# EAGLE design SNARFBASE-v03jj-232-buck (EAGLE 5.11)
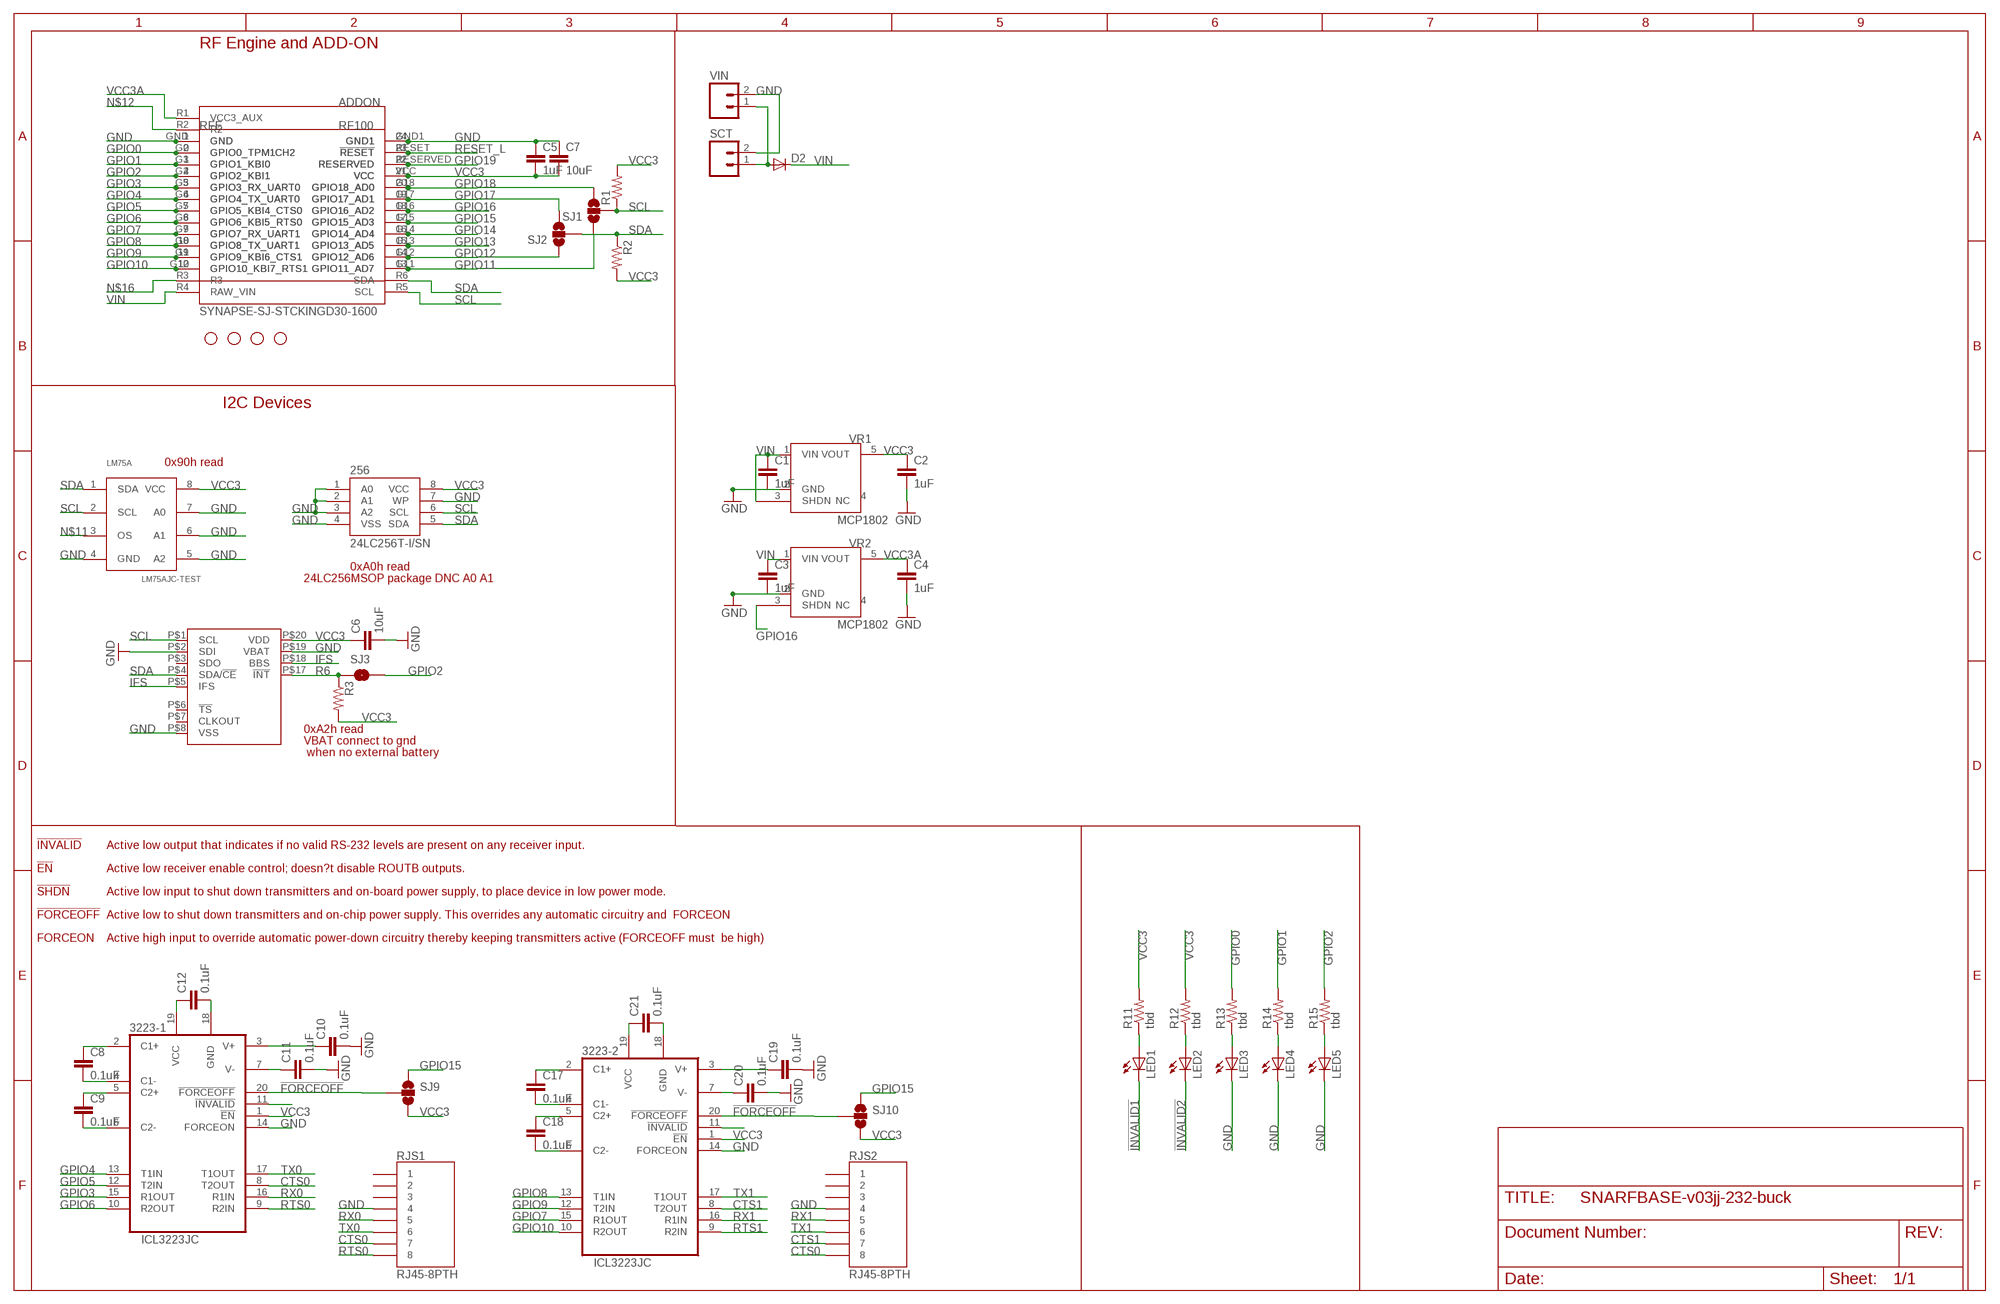
[diagram p0: schematic, sheet 1]

## Parts
256  24LC256T-I/SN  EEPROM-I2CSMD  [SO08]
3223-1  ICL3223JC  [TSSOP20-JC]
3223-2  ICL3223JC  [TSSOP20-JC]
ADDON  SYNAPSE-SJ-STCKINGD30-1600  [SYNSJ-STACK]
C1  1uF  CAP0805  [0805]
C2  1uF  CAP0805  [0805]
C3  1uF  CAP0805  [0805]
C4  1uF  CAP0805  [0805]
C5  1uF  CAP0805  [0805]
C6  10uF  CAP0805  [0805]
C7  10uF  CAP0805  [0805]
C8  0.1uF  CAP0805  [0805]
C9  0.1uF  CAP0805  [0805]
C10  0.1uF  CAP0805  [0805]
C11  0.1uF  CAP0805  [0805]
C12  0.1uF  CAP0805  [0805]
C17  0.1uF  CAP0805  [0805]
C18  0.1uF  CAP0805  [0805]
C19  0.1uF  CAP0805  [0805]
C20  0.1uF  CAP0805  [0805]
C21  0.1uF  CAP0805  [0805]
D2  DIODESMA  [SMA-DIODE]
JP6  STAND-OFF  [STAND-OFF]
JP9  STAND-OFF  [STAND-OFF]
JP10  STAND-OFF  [STAND-OFF]
JP11  STAND-OFF  [STAND-OFF]
LED1  LED0603  [LED-0603]
LED2  LED0603  [LED-0603]
LED3  LED0603  [LED-0603]
LED4  LED0603  [LED-0603]
LED5  LED0603  [LED-0603]
LM75A  LM75AJC-TEST  [TSSOP8-3MM]
PCF2129A  PCF2129ASO20  [SO20W]
R1  RESISTOR  [0805]
R2  RESISTOR  [0805]
R3  RESISTOR  [0805]
R11  tbd  RESISTOR0603-RES  [0603-RES]
R12  tbd  RESISTOR0603-RES  [0603-RES]
R13  tbd  RESISTOR0603-RES  [0603-RES]
R14  tbd  RESISTOR0603-RES  [0603-RES]
R15  tbd  RESISTOR0603-RES  [0603-RES]
RFE  RFE  RF100-JACKJACK2  [SYNAPSERFENGINE-THM-SMT-JACK2]
RJS1  RJ45-8PTH  [RJ45-8]
RJS2  RJ45-8PTH  [RJ45-8]
SCT  M023.5MM  [SCREWTERMINAL-3.5MM-2]
SJ1  SOLDERJUMPER_2WAYS  [SJ_3]
SJ2  SOLDERJUMPER_2WAYS  [SJ_3]
SJ3  SOLDERJUMPERNC2  [SJ_2S-NOTRACE]
SJ9  SOLDERJUMPER_2WAYPASTE1&2  [SJ_3_PASTE1&2]
SJ10  SOLDERJUMPER_2WAYPASTE1&2  [SJ_3_PASTE1&2]
VIN  M02PTH  [1X02]
VR1  MCP1802  [SOT23-5]
VR2  MCP1802  [SOT23-5]

## Nets
!FORCEOFF: 3223-1.20(!FORCEOFF) 3223-2.20(!FORCEOFF) SJ9.2 SJ10.2
!INVALID1: 3223-1.11(!INVALID) LED1.C
!INVALID2: 3223-2.11(!INVALID) LED2.C
CTS0: 3223-1.8(T2OUT) RJS1.7 RJS2.8
CTS1: 3223-2.8(T2OUT) RJS2.7
GND: 256.1(A0) 256.2(A1) 256.3(A2) 256.4(VSS) 256.7(WP) 3223-1.14(FORCEON) 3223-1.18(GND) 3223-2.14(FORCEON) 3223-2.18(GND) ADDON.GND ADDON.GND1 C1.2 C2.2 C3.2 C4.2 C5.1 C6.2 C7.1 C10.2 C11.2 C12.2 C19.2 C20.2 C21.2 LED3.C LED4.C LED5.C LM75A.4(GND) LM75A.5(A2) LM75A.6(A1) LM75A.7(A0) PCF2129A.P$2(SDI) PCF2129A.P$8(VSS) PCF2129A.P$19(VBAT) RFE.1(GND) RFE.24(GND1) RFE.P1 RFE.P24 RFE.P201 RFE.P224 RJS1.4 RJS2.4 SCT.2 VIN.2 VR1.2(GND) VR2.2(GND)
GPIO0: ADDON.G0(GPIO0_TPM1CH2) R13.2 RFE.2(GPIO0_TPM1CH2) RFE.P2 RFE.P202
GPIO1: ADDON.G1(GPIO1_KBI0) R14.2 RFE.3(GPIO1_KBI0) RFE.P3 RFE.P203
GPIO2: ADDON.G2(GPIO2_KBI1) R15.2 RFE.4(GPIO2_KBI1) RFE.P4 RFE.P204 SJ3.2
GPIO3: 3223-1.15(R1OUT) ADDON.G3(GPIO3_RX_UART0) RFE.5(GPIO3_RX_UART0) RFE.P5 RFE.P205
GPIO4: 3223-1.13(T1IN) ADDON.G4(GPIO4_TX_UART0) RFE.6(GPIO4_TX_UART0) RFE.P6 RFE.P206
GPIO5: 3223-1.12(T2IN) ADDON.G5(GPIO5_KBI4_CTS0) RFE.7(GPIO5_KBI4_CTS0) RFE.P7 RFE.P207
GPIO6: 3223-1.10(R2OUT) ADDON.G6(GPIO6_KBI5_RTS0) RFE.8(GPIO6_KBI5_RTS0) RFE.P8 RFE.P208
GPIO7: 3223-2.15(R1OUT) ADDON.G7(GPIO7_RX_UART1) RFE.9(GPIO7_RX_UART1) RFE.P9 RFE.P209
GPIO8: 3223-2.13(T1IN) ADDON.G8(GPIO8_TX_UART1) RFE.10(GPIO8_TX_UART1) RFE.P10 RFE.P210
GPIO9: 3223-2.12(T2IN) ADDON.G9(GPIO9_KBI6_CTS1) RFE.11(GPIO9_KBI6_CTS1) RFE.P11 RFE.P211
GPIO10: 3223-2.10(R2OUT) ADDON.G10(GPIO10_KBI7_RTS1) RFE.12(GPIO10_KBI7_RTS1) RFE.P12 RFE.P212
GPIO11: ADDON.G11(GPIO11_AD7) RFE.13(GPIO11_AD7) RFE.P13 RFE.P213 SJ1.1
GPIO12: ADDON.G12(GPIO12_AD6) RFE.14(GPIO12_AD6) RFE.P14 RFE.P214 SJ2.1
GPIO13: ADDON.G13(GPIO13_AD5) RFE.15(GPIO13_AD5) RFE.P15 RFE.P215
GPIO14: ADDON.G14(GPIO14_AD4) RFE.16(GPIO14_AD4) RFE.P16 RFE.P216
GPIO15: ADDON.G15(GPIO15_AD3) RFE.17(GPIO15_AD3) RFE.P17 RFE.P217 SJ9.1 SJ10.1
GPIO16: ADDON.G16(GPIO16_AD2) RFE.18(GPIO16_AD2) RFE.P18 RFE.P218 VR2.3(SHDN)
GPIO17: ADDON.G17(GPIO17_AD1) RFE.19(GPIO17_AD1) RFE.P19 RFE.P219 SJ2.3
GPIO18: ADDON.G18(GPIO18_AD0) RFE.20(GPIO18_AD0) RFE.P20 RFE.P220 SJ1.3
GPIO19: ADDON.RESERVED RFE.22(RESERVED) RFE.P22 RFE.P222
IFS: PCF2129A.P$5(IFS) PCF2129A.P$18(BBS)
N$1: LED1.A R11.1
N$2: LED2.A R12.1
N$3: LED3.A R13.1
N$4: 3223-1.2(C1+) C8.1
N$5: LED4.A R14.1
N$6: 3223-1.4(C1-) C8.2
N$7: 3223-1.3(V+) C10.1
N$8: 3223-1.7(V-) C11.1
N$9: LED5.A R15.1
N$11: LM75A.3(OS)
N$12: ADDON.R2
N$13: 3223-1.5(C2+) C9.1
N$14: 3223-1.6(C2-) C9.2
N$15: 3223-2.2(C1+) C17.1
N$16: ADDON.R3
N$17: 3223-2.4(C1-) C17.2
N$18: 3223-2.3(V+) C19.1
N$19: 3223-2.7(V-) C20.1
N$20: 3223-2.5(C2+) C18.1
N$21: 3223-2.6(C2-) C18.2
R6: PCF2129A.P$17(!INT) R3.1 SJ3.1
RESET_L: ADDON.RESET(!RESET) RFE.23(!RESET) RFE.P23 RFE.P223
RTS0: 3223-1.9(R2IN) RJS1.8
RTS1: 3223-2.9(R2IN)
RX0: 3223-1.16(R1IN) RJS1.5
RX1: 3223-2.16(R1IN) RJS2.5
SCL: 256.6(SCL) ADDON.R5(SCL) LM75A.2(SCL) PCF2129A.P$1(SCL) R1.1 SJ1.2
SDA: 256.5(SDA) ADDON.R6(SDA) LM75A.1(SDA) PCF2129A.P$4(SDA/!CE) R2.1 SJ2.2
TX0: 3223-1.17(T1OUT) RJS1.6
TX1: 3223-2.17(T1OUT) RJS2.6
VCC3: 256.8(VCC) 3223-1.1(!EN) 3223-1.19(VCC) 3223-2.1(!EN) 3223-2.19(VCC) ADDON.VCC C2.1 C5.2 C6.1 C7.2 C12.1 C21.1 LM75A.8(VCC) PCF2129A.P$20(VDD) R1.2 R2.2 R3.2 R11.2 R12.2 RFE.21(VCC) RFE.P21 RFE.P221 SJ9.3 SJ10.3 VR1.5(VOUT)
VCC3A: ADDON.R1(VCC3_AUX) C4.1 VR2.5(VOUT)
VIN: ADDON.R4(RAW_VIN) C1.1 C3.1 D2.C VR1.1(VIN) VR1.3(SHDN) VR2.1(VIN)
VIN_PREDIODE: D2.A SCT.1 VIN.1
Unconnected: PCF2129A.P$3(SDO) PCF2129A.P$6(!TS) PCF2129A.P$7(CLKOUT) RJS1.1 RJS1.2 RJS1.3 RJS2.1 RJS2.2 RJS2.3 VR1.4(NC) VR2.4(NC)

## Notes on the sheet
- RF Engine and ADD-ON
- I2C Devices
- 0x90h read
- 0xA0h read
- 24LC256MSOP package DNC A0 A1
- 0xA2h read
- VBAT connect to gnd
- when no external battery
- !INVALID | Active low output that indicates if no valid RS-232 levels are present on any receiver input.
- !EN | Active low receiver enable control; doesn?t disable ROUTB outputs.
- !SHDN | Active low input to shut down transmitters and on-board power supply, to place device in low power mode.
- !FORCEOFF | Active low to shut down transmitters and on-chip power supply. This overrides any automatic circuitry and  FORCEON
- FORCEON | Active high input to override automatic power-down circuitry thereby keeping transmitters active (FORCEOFF must  be high)

## Library data of the parts
256 = SparkFun:EEPROM-I2C
3223-1 3223-2 = 0_jc-custom:ICL3223
ADDON = 0_jc-custom:SYNAPSE-SJ-STCKING: Standard layout for expansion modules using Synapse Wireless boards
C1-C12 C17-C21 = 0_jc-custom:CAP: Capacitor Standard 0603 ceramic capacitor, and 0.1" leaded capacitor.
D2 = SparkFun:DIODE: Diode These are standard reverse protection diodes and small signal diodes. SMA package can handle up to about 1A. SOD-323 can handle about 200mA. What the SOD-323 package when ordering, there are some mfgs out there that are 5-pin packages.
JP6 JP9-JP11 = SparkFun:STAND-OFF: Stand Off This is the mechanical footprint for a #4 phillips button head screw. Use the keepout ring to avoid running the screw head into surrounding components. SKU : PRT-00447
LED1-LED5 = 0_jc-custom:LED: LEDs Standard schematic elements and footprints for 5mm, 3mm, 1206, and 0603 sized LEDs. 5mm - Spark Fun Electronics SKU : COM-00529 (and others)
LM75A = 0_jc-custom:LM75A
PCF2129A = 0_jc-custom:PCF2129A
R1-R3 = SparkFun:RESISTOR: Resistor Basic schematic elements and footprints for 0603, 1206, and PTH 1/10th watt (small) resistors.
R11-R15 = 0_jc-custom:RESISTOR
RFE = 0_jc-custom:RF100-JACK
RJS1 RJS2 = SparkFun:RJ45-8: RJ45 Jack Simple RJ45, 8-pin connection - connector for common Cat5, Cat5e, and Cat6 Ethernet cables. Footprint not yet proven in production. Connector sku is PRT-00643; Breakout PCB sku is BOB-00716.
SCT VIN = SparkFun:M02: Header 2 Standard 2-pin 0.1" header. Use with straight break away headers (SKU : PRT-00116), right angle break away headers (PRT-00553), swiss pins (PRT-00743), machine pins (PRT-00117), and female headers (PRT-00115). Molex polarized connector foot print use with SKU : PRT-08233 with associated crimp pins and housings.
SJ1 SJ2 SJ9 SJ10 = SparkFun:SOLDERJUMPER_2WAY: Solder Jumper 2 way solder jumper
SJ3 = SparkFun:SOLDERJUMPER: Solder Jumper Standard SMD solder jumper. Used to automate production. Two varients : Normally Open and Normally Closed are the same, but have different paste layers. NC will have a large amount of paste and should jumper during reflow.
VR1 VR2 = 0_jc-custom:MCP1802

## Net classes
0 default: width 0.254 mm
1 Power: width 0.508 mm
2 smallsignal: width 0.152 mm
3 stdsignal: width 0.254 mm

## Board
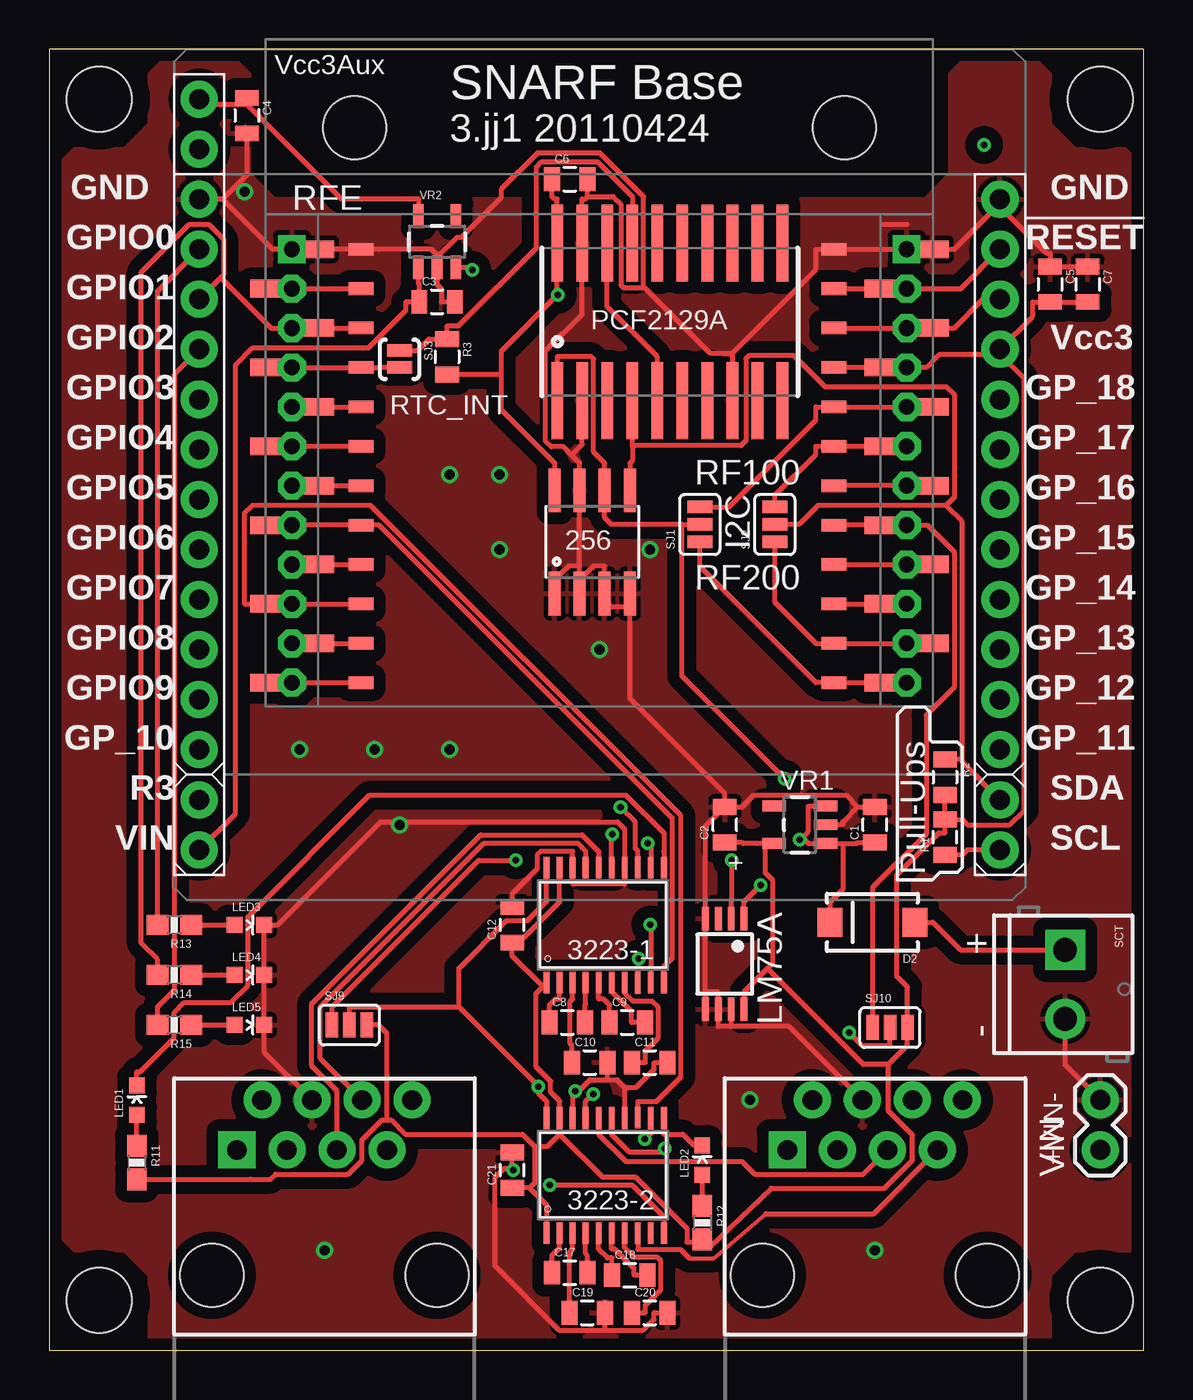
[diagram p1: board, top side]
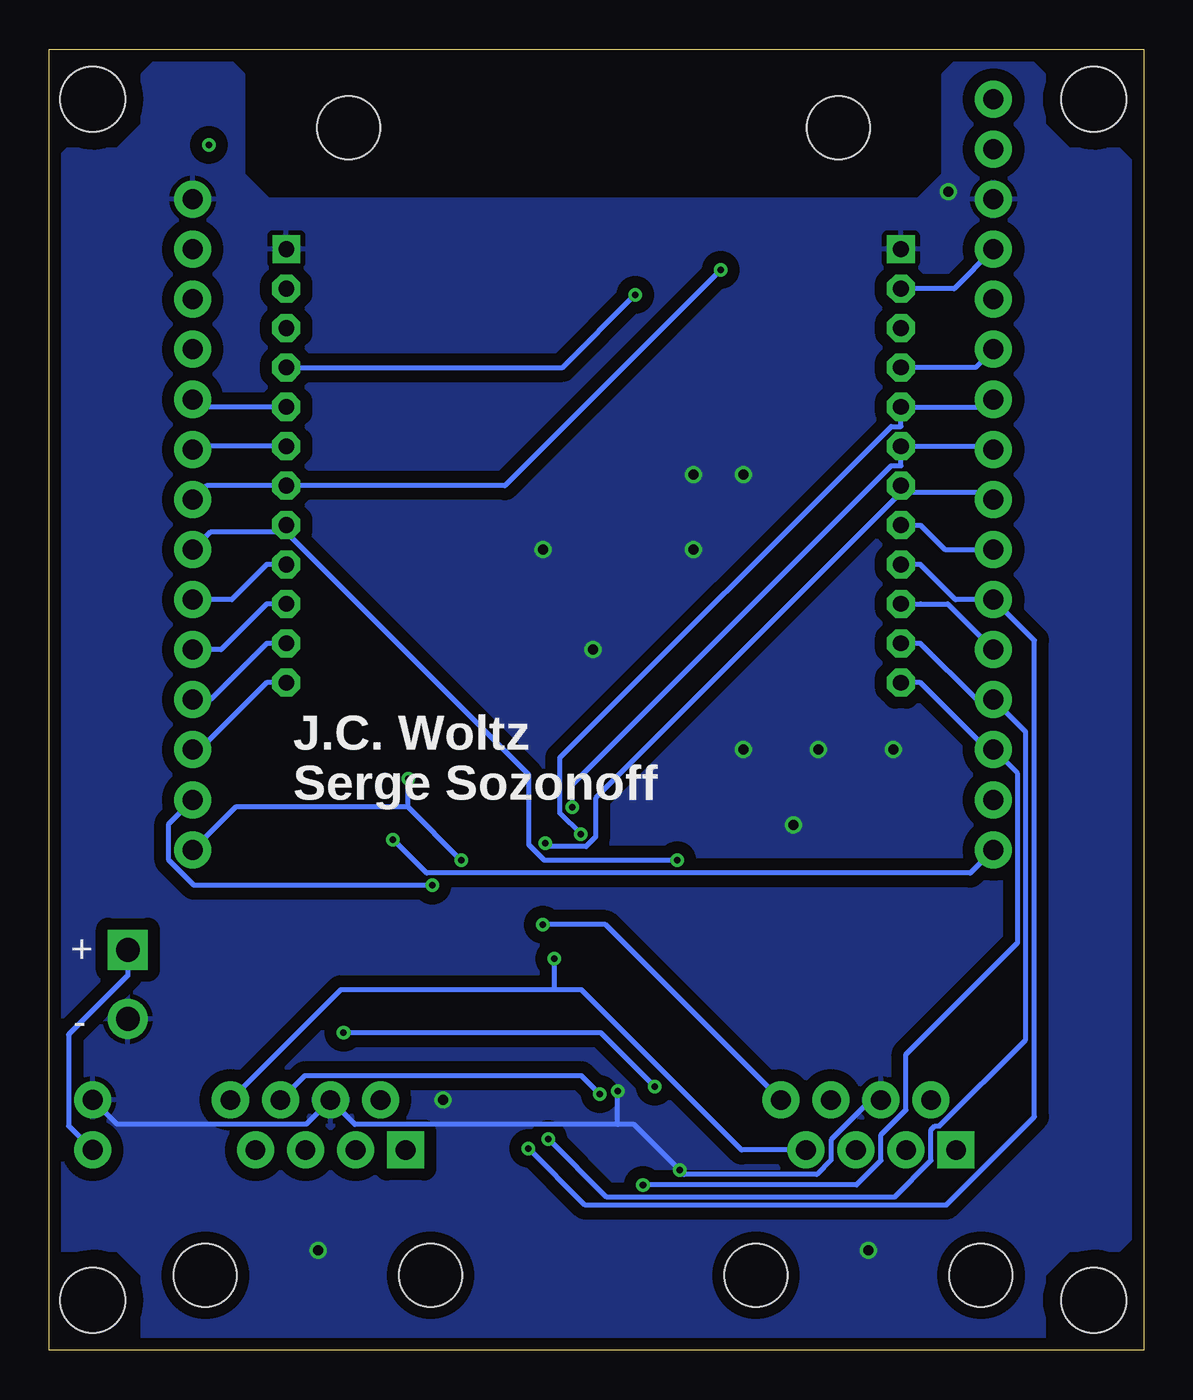
[diagram p2: board, bottom side, seen from below]

Size 55.55 x 66.03 mm. Coordinates in mm from the lower left corner, seen from the top.
Outline: 0,0 55.55,0 55.55,66.03 0,66.03 0,0
Copper layers (1*16): Top 0.0356mm / dielectric 1.5011mm / Bottom 0.0356mm
Design rules "LaenPCBOrder-JCModified": minimum track width 6mil, minimum drill 13mil, track to track 6mil, track to pad 6mil, pad to pad 6mil, via to via 6mil, smd to smd 6mil, copper to edge 15mil, drill to drill 6mil, minimum pad ring 12mil, minimum via ring 7mil, stop-mask expansion 4mil, vias tented up to drill 25mil, thermal gap 10mil

### Footprints (pad centres in the part's own frame; a part is rotated, then mirrored left to right if it is on the bottom)
SO08 = smd 0.61 x 2.21: 1 -1.905,-2.616; 2 -0.635,-2.616; 3 0.635,-2.616; 4 1.905,-2.616; 5 1.905,2.616; 6 0.635,2.616; 7 -0.635,2.616; 8 -1.905,2.616
TSSOP20-JC = smd 1.1 x 0.3: 1 -2.937,2.693; 2 -2.937,2.032; 3 -2.937,1.372; 4 -2.937,0.712; 5 -2.937,0.051; 6 -2.937,-0.609; 7 -2.937,-1.27; 8 -2.943,-1.93; 9 -2.937,-2.59; 10 -2.937,-3.251; 11 2.905,-3.251; 12 2.905,-2.59; 13 2.911,-1.93; 14 2.905,-1.27; 15 2.905,-0.609; 16 2.905,0.051; 17 2.905,0.712; 18 2.905,1.372; 19 2.905,2.032; 20 2.905,2.693
SYNSJ-STACK = drill 1.016 pad 1.88 round: G0 0,-7.62; G1 0,-10.16; G2 0,-12.7; G3 0,-15.24; G4 0,-17.78; G5 0,-20.32; G6 0,-22.86; G7 0,-25.4; G8 0,-27.94; G9 0,-30.48; G10 0,-33.02; G11 40.64,-33.02; G12 40.64,-30.48; G13 40.64,-27.94; G14 40.64,-25.4; G15 40.64,-22.86; G16 40.64,-20.32; G17 40.64,-17.78; G18 40.64,-15.24; GND 0,-5.08; GND1 40.64,-5.08; R1 0,0; R2 0,-2.54; R3 0,-35.56; R4 0,-38.1; R5 40.64,-38.1; R6 40.64,-35.56; RESERVED 40.64,-10.16; RESET 40.64,-7.62; VCC 40.64,-12.7
0805 = smd 0.8 x 1.2: 1 -0.9,0; 2 0.9,0
SMA-DIODE = smd 1.27 x 1.47: A -2.15,0; C 2.15,0
STAND-OFF = hole 3.302: 0,0
LED-0603 = smd 0.8 x 0.8: A 0,-0.75; C 0,0.75
TSSOP8-3MM = smd 1.2 x 0.35: 1 -2.6,0.975; 2 -2.6,0.325; 3 -2.6,-0.325; 4 -2.6,-0.975; 5 2,-0.975; 6 2,-0.325; 7 2,0.325; 8 2,0.975
SO20W = smd 0.6 x 3.9: P$1 -5.715,-4; P$2 -4.445,-4; P$3 -3.175,-4; P$4 -1.905,-4; P$5 -0.635,-4; P$6 0.635,-4; P$7 1.905,-4; P$8 3.175,-4; P$9 4.445,-4; P$10 5.715,-4; P$11 5.715,4; P$12 4.445,4; P$13 3.175,4; P$14 1.905,4; P$15 0.635,4; P$16 -0.635,4; P$17 -1.905,4; P$18 -3.175,4; P$19 -4.445,4; P$20 -5.715,4
0603-RES = smd 1.1 x 1: 1 -0.85,0; 2 0.85,0
SYNAPSERFENGINE-THM-SMT-JACK2 = drill 0.8 square: 1 0,0; 24 31.2,0 | drill 0.8 pad 1.422 octagon: 2 0,-2; 3 0,-4; 4 0,-6; 5 0,-8; 6 0,-10; 7 0,-12; 8 0,-14; 9 0,-16; 10 0,-18; 11 0,-20; 12 0,-22; 13 31.2,-22; 14 31.2,-20; 15 31.2,-18; 16 31.2,-16; 17 31.2,-14; 18 31.2,-12; 19 31.2,-10; 20 31.2,-8; 21 31.2,-6; 22 31.2,-4; 23 31.2,-2 | smd 1.67 x 0.89: P1 1.3,0; P2 -1.3,-2; P3 1.3,-4; P4 -1.3,-6; P5 1.3,-8; P6 -1.3,-10; P7 1.3,-12; P8 -1.3,-14; P9 1.3,-16; P10 -1.3,-18; P11 1.3,-20; P12 -1.3,-22; P13 29.9,-22; P14 32.5,-20; P15 29.9,-18; P16 32.5,-16; P17 29.9,-14; P18 32.5,-12; P19 29.9,-10; P20 32.5,-8; P21 29.9,-6; P22 32.5,-4; P23 29.9,-2; P24 32.5,0 | smd 1.27 x 0.635: P201 3.5,0; P202 3.5,-2; P203 3.5,-4; P204 3.5,-6; P205 3.5,-8; P206 3.5,-10; P207 3.5,-12; P208 3.5,-14; P209 3.5,-16; P210 3.5,-18; P211 3.5,-20; P212 3.5,-22; P213 27.5,-22; P214 27.5,-20; P215 27.5,-18; P216 27.5,-16; P217 27.5,-14; P218 27.5,-12; P219 27.5,-10; P220 27.5,-8; P221 27.5,-6; P222 27.5,-4; P223 27.5,-2; P224 27.5,0 | hole 3.2: 3.17,6.16; 28.03,6.16
RJ45-8 = drill 1 pad 1.88 square: 1 -4.445,6.35 | drill 1 pad 1.88 round: 2 -3.175,8.89; 3 -1.905,6.35; 4 -0.635,8.89; 5 0.635,6.35; 6 1.905,8.89; 7 3.175,6.35; 8 4.445,8.89 | hole 3.2: -5.715,0; 5.715,0
SCREWTERMINAL-3.5MM-2 = drill 1.2 pad 2.032 square: 1 0,0 | drill 1.2 pad 2.032 round: 2 3.5,0
SJ_3 = smd 0.635 x 1.27: 1 -0.889,0; 2 0,0; 3 0.889,0
SJ_2S-NOTRACE = smd 0.635 x 1.27: 1 -0.45,0; 2 0.4,0
SJ_3_PASTE1&2 = smd 0.635 x 1.27: 1 -0.889,0; 2 0,0; 3 0.889,0
1X02 = drill 1.016 pad 1.88 round: 1 0,0; 2 2.54,0
SOT23-5 = smd 0.55 x 1.2: 1 -0.95,-1.3; 2 0,-1.3; 3 0.95,-1.3; 4 0.95,1.3; 5 -0.95,1.3

### Placement (x,y rotation side)
256  27.56,41.02 0 top
3223-1  27.94,21.59 90 top
3223-2  27.94,8.89 90 top
ADDON  7.62,63.5 0 top
C1  41.91,26.67 90 top
C2  34.29,26.67 90 top
C3  19.68,53.21 0 top
C4  10.03,62.66 270 top
C5  50.8,54.1 270 top
C6  26.42,59.44 0 top
C7  52.7,54.1 270 top
C8  26.29,16.64 0 top
C9  29.34,16.64 0 top
C10  27.43,14.61 0 top
C11  30.48,14.61 0 top
C12  23.5,21.59 90 top
C17  26.42,3.94 0 top
C18  29.46,3.81 0 top
C19  27.3,1.91 0 top
C20  30.48,1.91 0 top
C21  23.5,9.14 90 top
D2  41.78,21.72 180 top
JP6  53.34,2.54 0 top
JP9  2.54,2.54 0 top
JP10  53.34,63.5 0 top
JP11  2.54,63.5 0 top
LED1  4.45,12.7 0 top
LED2  33.15,9.65 0 top
LED3  10.16,21.59 270 top
LED4  10.16,19.05 270 top
LED5  10.16,16.51 270 top
LM75A  34.29,19.3 270 top
PCF2129A  31.5,52.2 0 top
R1  45.47,26.04 90 top
R2  45.47,29.08 270 top
R3  20.19,50.42 270 top
R11  4.45,9.53 270 top
R12  33.15,6.48 270 top
R13  6.35,21.59 180 top
R14  6.35,19.05 180 top
R15  6.35,16.51 180 top
RFE  12.32,55.88 0 top
RJS1  13.97,3.81 0 top
RJS2  41.91,3.81 0 top
SCT  51.56,20.32 270 top
SJ1  33.02,41.91 90 top
SJ2  36.83,41.91 90 top
SJ3  17.78,50.29 270 top
SJ9  15.24,16.51 0 top
SJ10  42.67,16.38 0 top
VIN  53.34,10.16 90 top
VR1  38.1,26.67 90 top
VR2  19.68,56.26 0 top

### Tracks (layer width: path | path; a pad name or v marks a point on that pad's centre or on a via)
!FORCEOFF  (via drill 0.33 pad 0.69)
  Top 0.254: 20.79,17.42 15.24,17.42 SJ9.2 | 20.79,17.42 v24.82,13.39 24.82,13.05 25.25,12.62 3223-2.20 | 3223-1.20 25.25,22.77 24.28,21.81 23.21,21.81 20.79,19.39 20.79,17.42 | SJ10.2 42.67,15.47 41.25,15.47 v40.61,16.11
  Bottom 0.254: v40.61,16.11 27.55,16.11 v24.82,13.39
!INVALID1
  Top 0.254: 3223-1.11 31.19,25.32 31.19,26.24 29.26,28.18 16.26,28.18 10.09,22 10.09,18.53 9.21,17.64 6.86,17.64 6.33,17.12 6.33,15.84 4.62,14.13 4.45,14.13 LED1.C
!INVALID2
  Top 0.254: LED2.C 32.72,10.4 32.16,10.97 31.19,10.97 3223-2.11
BOB  (via drill 0.33 pad 0.69)
  other vias: 47.45,61.16
CTS0  (via drill 0.33 pad 0.69)
  Top 0.254: v29.91,19.87 29.87,19.83 3223-1.8
  Bottom 0.254: 29.91,18.3 28.54,18.3 20.41,10.16 RJS1.7 | RJS2.8 40.76,18.3 29.91,18.3 | 29.91,18.3 v29.91,19.87
CTS1
  Top 0.203: 36.38,6.93 33.73,4.67 32.49,4.67
  Top 0.254: 3223-2.8 29.87,5.12 32.04,5.12 32.49,4.67 | RJS2.7 41.86,6.93 36.38,6.93
GND  (via drill 0.33 pad 0.69, 0.51)
  Top 0.254: C12.2 23.5,23.17 24.76,24.44 24.76,25.13 24.96,25.32 26.57,25.32 3223-1.18 26.57,24.18 26.57,23.69 26.59,23.67 29.21,23.67 3223-1.14 29.21,25.32 29.21,26.45 28.84,26.82 16.82,26.82 11.59,21.59 LED3.C LED4.C LED5.C 10.91,16.17 10.91,15.83 10.91,15.12 RJS1.4 | 26.78,13.06 27.45,13.73 28.33,13.73 | 3223-2.18 26.57,12.85 26.78,13.06 | v26.7,13.15 26.78,13.06 | 33.31,18.18 LM75A.5 | C11.2 30.7,14.61 30.7,14.27 29.77,13.34 29.21,13.34 | 34.62,16.42 33.97,16.42 LM75A.6 33.97,18.18 33.31,18.18 | 34.29,27.59 33.31,26.62 33.31,22.78 LM75A.4 33.31,18.18 | 34.29,27.59 34.29,28.25 29.46,33.08 29.46,37.71 | 34.29,27.59 C2.2 35.17,27.57 35.77,28.18 40.43,28.18 41.03,27.57 | 23.5,9.2 C21.2 | v23.55,9.15 23.5,9.2 | 23.5,9.2 23.05,9.2 22.6,8.76 22.6,4.31 25.89,1.03 28.2,1.03 | 30.17,53.99 30.1,53.92 29.16,53.92 29.01,54.06 29.01,58.16 28.61,58.56 27.32,58.56 | 19.68,55.47 20.69,56.47 20.91,56.47 22.94,58.5 22.94,58.92 24.78,60.76 27.96,60.76 30.17,58.55 30.17,53.99 | 34.67,50.62 33.55,50.62 30.17,53.99 | 19.68,55.47 19.68,55.58 19.39,55.88 16.73,55.88 RFE.P201 RFE.P1 RFE.1 11.34,55.88 8.79,58.42 | 19.68,55.47 19.68,55.35 VR2.2 19.68,54.08 19.91,53.86 19.91,53.21 C3.2 | 26.92,39.1 27.62,39.79 28.19,39.79 256.3 28.19,38.06 28.54,37.71 29.46,37.71 | 26.92,39.1 26.92,39.79 | 26.92,39.1 256.2 | 26.92,39.79 256.7 26.92,45.02 26.52,45.43 | 26.92,39.79 26.35,39.79 25.65,39.1 256.1 | 26.52,45.43 26.09,45.86 25.47,45.86 25.2,46.13 25.2,50.72 27.05,52.57 PCF2129A.P$19 27.05,58.43 27.19,58.43 27.32,58.56 | 8.79,58.42 ADDON.GND | C4.2 10.03,59.66 8.79,58.42 | 28.2,1.03 30.16,1.03 30.7,1.56 30.7,1.91 C20.2
  Top 0.254: 28.2,1.03 28.2,1.13 C19.2 | 34.62,16.42 37.55,16.42 RJS2.4 | 34.62,16.42 34.62,16.53 LM75A.7 | 29.46,37.71 256.4 | 29.21,13.34 29.21,12.62 3223-2.14 | 28.33,13.73 28.82,13.73 29.21,13.34 | 34.67,50.62 38.9,54.85 38.9,55.88 RFE.P224 RFE.24 RFE.P24 45.93,55.88 48.17,58.12 | 34.67,50.62 34.67,50.43 PCF2129A.P$8 | 27.32,58.56 C6.2 | 28.33,13.73 C10.2 | 48.17,58.12 50.61,55.68 50.8,55.68 C5.1 51.83,55 C7.1 | ADDON.GND1 48.17,58.33 48.17,58.12 | 48.17,58.12 | 26.52,45.43 27.05,45.97 PCF2129A.P$2 | VIN.2 51.56,14.48 SCT.2 | VR1.2 40.28,26.67 40.28,26.82 41.03,27.57 | 41.03,27.57 C1.2 | 42.25,57.15 43.55,57.15
  Bottom 0.254: 26.7,11.46 v26.7,13.15 | 26.7,11.46 40.04,11.46 RJS2.4 42.51,11.47 52.11,11.47 VIN.2 | 26.7,11.46 25.87,11.46 v23.55,9.15 23.33,8.93 16.6,8.93 15.88,9.65 15.88,10.67 13.84,12.7 RJS1.4
  other vias: 22.86,44.45 12.7,30.48 22.86,40.64 27.94,35.56 30.48,40.64 20.32,44.45 9.91,58.8 17.78,26.67 13.97,5.08 41.91,5.08 35.56,12.7 16.51,30.48 20.32,30.48
  pour Top (isolate 0.61): 0,59.69 0,6.35 1.27,5.08 3.81,5.08 5.08,3.81 5.08,0 50.8,0 50.8,3.81 52.07,5.08 55.88,5.08 55.88,59.69 54.61,60.96 52.07,60.96 50.8,62.23 50.8,64.77 49.53,66.04 46.99,66.04 45.72,64.77 45.72,59.69 44.45,58.42 11.43,58.42 10.16,59.69 10.16,64.77 8.89,66.04 6.35,66.04 5.08,64.77 5.08,62.23 3.81,60.96 1.27,60.96
  pour Bottom (isolate 0.61): 0,59.69 0,6.35 1.27,5.08 3.81,5.08 5.08,3.81 5.08,0 50.8,0 50.8,3.81 52.07,5.08 55.88,5.08 55.88,59.69 54.61,60.96 52.07,60.96 50.8,62.23 50.8,64.77 49.53,66.04 46.99,66.04 45.72,64.77 45.72,59.69 44.45,58.42 11.43,58.42 10.16,59.69 10.16,64.77 8.89,66.04 6.35,66.04 5.08,64.77 5.08,62.23 3.81,60.96 1.27,60.96
GPIO0
  Top 0.254: ADDON.G0 5.5,53.76 R13.2 | RFE.P2 RFE.2 RFE.P202
  Bottom 0.254: RFE.2 9.62,53.88 ADDON.G0
GPIO1
  Top 0.254: 8.71,54.43 8.85,54.57 8.85,56.38 8.09,57.15 7.1,57.15 4.67,54.72 4.67,20.66 5.5,19.83 R14.2 | 8.71,54.43 ADDON.G1 | 8.71,54.43 11.26,51.88 RFE.3 RFE.P3 RFE.P203
GPIO2
  Top 0.254: ADDON.G2 6.37,49.55 6.37,18.29 5.5,17.41 R15.2 | SJ3.2 16.87,49.89 16.85,49.88 RFE.P204 RFE.4 RFE.P4
  Bottom 0.254: RFE.4 8.54,49.88 ADDON.G2
GPIO3  (via drill 0.33 pad 0.69)
  Top 0.254: v28.57,26.2 28.55,26.18 3223-1.15 | RFE.P205 RFE.P5 RFE.5
  Bottom 0.254: v28.57,26.2 29.63,27.25 29.63,30.08 12.81,46.89 12.32,46.89 RFE.5 8,47.88 ADDON.G3
GPIO4  (via drill 0.33 pad 0.69)
  Top 0.254: v28.99,27.55 29.74,26.8 29.74,25.46 29.87,25.33 3223-1.13 | RFE.P6 12.13,45.88 RFE.6 RFE.P206
  Bottom 0.254: v28.99,27.55 28.99,28.71 12.81,44.89 12.32,44.89 RFE.6 7.78,45.88 ADDON.G4
GPIO5  (via drill 0.33 pad 0.69)
  Top 0.254: 3223-1.12 30.53,25.56 v30.36,25.72 | RFE.7 RFE.P7 RFE.P207
  Bottom 0.254: 12.32,43.52 27.82,28.02 27.82,26.05 28.3,25.57 30.21,25.57 v30.36,25.72 | ADDON.G5 7.96,43.52 12.32,43.52 | 12.32,43.52 RFE.7
GPIO6
  Top 0.254: 3223-1.10 31.19,19.48 31.62,19.91 31.62,26.99 16.73,41.88 RFE.P208 RFE.8 RFE.P8
  Bottom 0.254: RFE.8 11.33,41.88 10.09,40.64 ADDON.G6
GPIO7  (via drill 0.33 pad 0.69)
  Top 0.254: 3223-2.15 28.55,10.97 29.46,10.05 31.03,10.05 v31.23,10.25 | RFE.P209 RFE.P9 RFE.9
  Bottom 0.254: v31.23,10.25 28.34,7.36 10.03,7.36 5.55,11.85 5.55,36.03 ADDON.G7 9.55,38.1 11.33,39.88 RFE.9
GPIO8
  Top 0.254: 3223-2.13 29.87,12.63 30.83,12.63 32.06,13.87 32.06,27.13 16.31,42.88 10.32,42.88 9.9,42.47 9.9,37.88 RFE.P10 RFE.10 RFE.P210
  Bottom 0.254: ADDON.G8 9.94,37.88 11.33,37.88 RFE.10
GPIO9  (via drill 0.33 pad 0.69)
  Top 0.254: 3223-2.12 30.53,10.97 30.46,10.97 v30.22,10.72 | RFE.11 RFE.P11 RFE.P211
  Bottom 0.254: v30.22,10.72 27.26,7.77 12.66,7.77 10.8,9.63 10.8,11.18 10.59,11.38 10.36,11.38 5.99,15.76 5.99,31.39 ADDON.G9 8.47,33.02 11.33,35.88 RFE.11
GPIO10  (via drill 0.33 pad 0.69)
  Top 0.254: 3223-2.10 31.19,6.78 29.58,8.39 v25.41,8.39 | RFE.P12 RFE.12 RFE.P212
  Bottom 0.254: v25.41,8.39 14.58,8.39 13.34,9.63 13.34,10.92 12.06,12.19 12.06,15.02 6.4,20.69 6.4,29.26 ADDON.G10 7.93,30.48 11.33,33.88 RFE.12
GPIO11
  Top 0.254: SJ1.1 33.02,40.42 33.02,39.76 38.9,33.88 RFE.P213 RFE.P13 RFE.13
  Bottom 0.254: RFE.13 44.51,33.88 47.91,30.48 ADDON.G11
GPIO12
  Top 0.254: RFE.P14 RFE.14 RFE.P214 38.9,35.88 36.83,37.95 SJ2.1
  Bottom 0.254: RFE.14 44.51,35.88 47.37,33.02 ADDON.G12
GPIO13
  Top 0.254: RFE.15 RFE.P15 RFE.P215
  Bottom 0.254: RFE.15 44.51,37.88 46.83,35.56 ADDON.G13
GPIO14
  Top 0.254: RFE.P16 RFE.16 RFE.P216
  Bottom 0.254: RFE.16 44.51,39.88 46.29,38.1 ADDON.G14
GPIO15  (via drill 0.33 pad 0.69)
  Top 0.254: SJ9.1 14.35,17.42 21.79,24.86 v23.69,24.86 | SJ10.1 41.78,23.48 44.51,26.2 44.51,32.23 45.93,33.66 45.93,40.52 44.57,41.88 RFE.17 RFE.P17 RFE.P217
  Bottom 0.254: 43.52,41.52 31.21,29.21 31.21,25.65 30.42,24.86 v23.69,24.86 | ADDON.G15 47.38,41.52 43.52,41.52 | 43.52,41.52 RFE.17
GPIO16  (via drill 0.33 pad 0.69)
  Top 0.254: RFE.P218 RFE.18 RFE.P18 | VR2.3 21.34,54.96 v21.46,54.84
  Bottom 0.254: v21.46,54.84 32.42,43.88 RFE.18 47.56,43.88 ADDON.G16
GPIO17
  Top 0.254: RFE.19 RFE.P19 41.66,45.88 41.1,45.88 RFE.P219 38.9,45.88 38.9,45.47 36.83,43.4 SJ2.3
  Bottom 0.254: RFE.19 48.1,45.88 ADDON.G17
GPIO18
  Top 0.254: SJ1.3 34.5,42.8 38.9,47.2 38.9,47.88 RFE.P220 RFE.20 RFE.P20
  Bottom 0.254: RFE.20 47.88,47.88 ADDON.G18
GPIO19
  Top 0.254: ADDON.RESERVED 47.39,53.34 45.93,51.88 RFE.P22 RFE.22 RFE.P222
IFS
  Top 0.254: PCF2129A.P$5 30.86,50.43 28.32,52.97 PCF2129A.P$18
N$1
  Top 0.254: R11.1 LED1.A
N$2
  Top 0.254: R12.1 LED2.A
N$3
  Top 0.254: R13.1 LED3.A
N$4
  Top 0.254: 3223-1.2 25.91,17.82 25.7,17.82 25.39,17.52 C8.1
N$5
  Top 0.254: LED4.A 8.73,19.05 R14.1
N$6
  Top 0.254: C8.2 27.19,17.52 27.23,17.56 3223-1.4
N$7
  Top 0.254: 3223-1.3 26.57,17.82 26.44,17.7 26.44,15.57 26.53,15.48 C10.1
N$8
  Top 0.254: C11.1 30.26,14.61 30.26,15.2 30.92,15.86 30.92,17.39 30.6,17.71 29.62,17.71 29.21,18.12 3223-1.7
N$9
  Top 0.254: R15.1 LED5.A
N$13
  Top 0.254: 3223-1.5 27.89,17.82 28.13,17.82 28.44,17.52 C9.1
N$14
  Top 0.254: C9.2 29.56,16.64 29.56,17.2 28.55,18.21 3223-1.6
N$15
  Top 0.254: 3223-2.2 25.91,5.12 25.82,5.12 25.52,4.82 C17.1
N$17
  Top 0.254: C17.2 27.32,4.82 27.23,4.9 3223-2.4
N$18
  Top 0.254: 3223-2.3 26.57,5.12 26.41,4.96 C19.1
N$19
  Top 0.254: C20.1 30.26,1.91 30.26,2.29 31.04,3.08 31.04,4.54 30.87,4.71 29.7,4.71 29.21,5.2 3223-2.7
N$20
  Top 0.254: 3223-2.5 27.89,5.12 28.32,4.69 28.56,4.69 C18.1
N$21
  Top 0.254: 3223-2.6 28.55,5.12 28.71,5.12 29.68,4.15 29.68,3.81 C18.2
R6
  Top 0.254: PCF2129A.P$17 29.59,58.56 27.83,60.32 25,60.32 24.73,60.05 24.73,55.94 20.79,52 20.19,52 R3.1 19.27,51.32 18.7,50.74 SJ3.1
RESET_L
  Top 0.254: ADDON.RESET 46.26,53.88 RFE.23 RFE.P23 RFE.P223
RTS0  (via drill 0.33 pad 0.69)
  Top 0.254: v30.5,21.6 30.53,21.57 30.53,19.48 3223-1.9
  Bottom 0.254: RJS1.8 27.32,21.6 v30.5,21.6
RX0
  Top 0.254: 3223-1.16 27.89,25.32 27.05,26.16 21.9,26.16 13.32,17.58 13.32,14.45 14.61,13.16 RJS1.5
RX1
  Top 0.254: 3223-2.16 27.89,10.97 29.27,9.58 35.16,9.58 35.82,8.93 41.31,8.93 RJS2.5
SCL  (via drill 0.33 pad 0.69)
  Top 0.254: LM75A.2 34.62,22.78 34.64,22.81 v34.64,24.86 | 32.1,41.91 28.54,41.91 28.19,42.25 256.6 28.19,45.02 27.63,45.59 27.63,50.31 27.51,50.43 25.78,50.43 PCF2129A.P$1 | 32.1,41.91 SJ1.2 | v37.33,29 32.1,34.23 32.1,41.91 | R1.1 46.35,25.14 46.61,25.4 ADDON.R5
  Bottom 0.254: v34.64,24.86 37.34,27.57 | ADDON.R5 46.09,27.57 37.34,27.57 | 37.34,27.57 37.34,28.99 v37.33,29
SDA  (via drill 0.33 pad 0.69)
  Top 0.254: LM75A.1 35.27,22.78 35.3,22.78 v36.1,23.59 | 45.52,42.88 45.95,43.32 45.95,48.48 45.54,48.89 39.39,48.89 37.8,50.47 35.52,50.47 35.36,50.32 35.36,46.16 35.11,45.91 29.59,45.91 | SJ2.2 38.05,41.91 39.02,42.88 45.52,42.88 | 45.52,42.88 46.35,42.05 46.35,29.98 | 29.59,45.91 29.59,45.15 29.46,45.02 256.5 | 29.59,45.91 PCF2129A.P$4 | 46.35,29.98 R2.1 | 46.35,29.98 46.35,29.86 ADDON.R6
  Bottom 0.254: ADDON.R6 49.48,26.72 49.48,24.88 48.2,23.59 v36.1,23.59
TX0
  Top 0.254: 3223-1.17 27.23,25.32 26.81,25.74 22.07,25.74 13.75,17.42 13.75,14.82 RJS1.6
TX1  (via drill 0.33 pad 0.69)
  Top 0.254: 3223-2.17 27.23,12.62 v27.61,13.01
  Bottom 0.254: RJS2.6 42.58,13.93 28.54,13.93 v27.61,13.01
VCC3  (via drill 0.33 pad 0.69)
  Top 0.254: 36.45,19.37 36.73,19.64 36.73,23.85 36.36,24.21 | 36.36,24.21 | 36.36,24.21 36.36,25.72 | 36.45,19.37 35.27,18.18 LM75A.8 | 36.45,19.37 41.32,14.5 42.59,14.5 | 42.59,14.5 43.56,15.47 SJ10.3 43.56,18.44 43.02,18.98 43.02,24.13 45.14,26.26 45.47,26.26 R1.2 | 42.59,14.5 42.59,12.14 43.81,10.92 43.81,9.64 42.4,8.22 36.65,8.22 33.55,5.25 33.53,5.25 R12.2 33.02,5.5 32.37,5.5 32.37,6.18 29.75,8.8 28.07,8.8 25.91,10.97 | 24.62,10.36 25.3,10.36 25.91,10.97 | 25.91,10.97 3223-2.19 25.91,12.62 25.91,12.65 25.45,13.11 25.45,13.65 24.71,14.39 24.71,18.11 25.05,18.46 | 24.62,10.36 24.62,8.49 24.38,8.24 | 17.14,11.68 17.35,11.68 18.06,10.96 24.01,10.96 24.62,10.36 | 24.38,8.24 25.25,7.37 25.25,6.78 3223-2.1 | 36.36,25.72 35.92,25.72 35.22,25.72 35.17,25.77 C2.1 | 36.36,25.72 VR1.5 | R1.2 46.35,26.93 46.61,26.67 48.74,26.67 49.48,27.41 49.48,49.3 48.26,50.52 | 17.14,11.68 16.89,11.68 15.88,10.67 15.88,9.64 15.18,8.94 11.49,8.94 11.22,8.68 10.2,8.68 R11.2 | 17.14,11.68 17.14,16.09 16.73,16.51 SJ9.3 | 23.5,20.35 25.91,22.76 3223-1.19 | 23.5,20.35 23.5,20.01 25.05,18.46 | 23.5,20.35 C12.1 | 25.05,18.46 3223-1.1 | C6.1 25.52,58.56 25.65,58.43 25.78,58.43 PCF2129A.P$20 25.78,53.59 v25.81,53.57 22.94,50.7 22.94,49.52 | 22.94,49.52 22.94,47.74 25.65,45.02 256.8 | 22.94,49.52 R3.2 | 24.38,8.24 C21.1 | 48.26,50.52 45.15,50.52 44.51,49.88 RFE.21 RFE.P21 RFE.P221 | 48.26,50.52 ADDON.VCC 49.92,52.46 49.92,53.2 C5.2 C7.2 | R1.2 R2.2
  Bottom 0.254: RFE.21 29.49,49.88 v25.81,53.57
VCC3A
  Top 0.254: VR2.5 18.73,58.44 14.81,58.44 10.03,63.22 | 10.03,63.22 7.9,63.22 ADDON.R1 | 10.03,63.22 C4.1
VIN  (via drill 0.33 pad 0.69)
  Top 0.254: VR1.3 38.52,27.62 38.52,26.34 v38.1,25.92 38.32,25.92 38.52,25.72 VR1.1 40.28,25.72 | ADDON.R4 9.45,27.23 9.45,50 10.33,50.88 16.2,50.88 18.11,52.79 18.11,53.21 C3.1 18.79,54.09 18.73,54.14 VR2.1 | 40.28,25.72 40.98,25.72 41.03,25.77 C1.1 | D2.C 39.63,22.73 40.28,23.38 40.28,25.72
  Bottom 0.254: ADDON.R4 8.81,24.21 36.4,24.21 v38.1,25.92
VIN_PREDIODE
  Top 0.254: D2.A 44.85,21.72 46.24,20.32 SCT.1
  Bottom 0.254: SCT.1 51.56,19.02 54.57,16.02 54.57,11.39 VIN.1

### Text on the board
tPlace: Vcc3Aux | SNARF Base | 3.jj1 20110424 | GND | GND | GPIO0 | !RESET | GPIO1 | GPIO2 | Vcc3 | GPIO3 | GP_18 | GPIO4 | RTC_INT | GP_17 | RF100 | GPIO5 | GP_16 | GPIO6 | I2C | GP_15 | RF200 | GPIO7 | GP_14 | GPIO8 | GP_13 | GPIO9 | GP_12 | GP_10 | GP_11 | R3 | SDA | VIN | SCL | + | Pull-Ups | + | - | +VIN-
bPlace: J.C. Woltz | Serge Sozonoff | + | -